# Altium schematic sheet LED7 SEGMENT.SchDoc
size A4
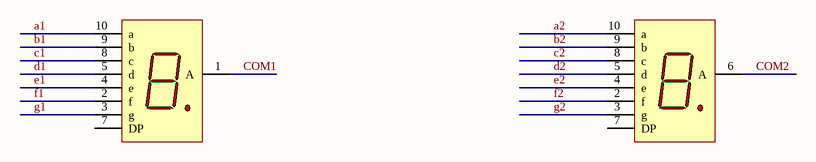
[diagram p0: LED7 SEGMENT.SchDoc]

## Parts
DS1  Dpy Red-CA  [7SEG-HY-A3613SR]  (value not drawn)
DS2  Dpy Red-CA  [7SEG-HY-A3613SR]  (value not drawn)

## Nets
a1: DS1.10(a)
a2: DS2.10(a)
b1: DS1.9(b)
b2: DS2.9(b)
c1: DS1.8(A)
c2: DS2.8(A)
COM1: DS1.1(A)
COM2: DS2.6(A)
d1: DS1.5(d)
d2: DS2.5(d)
e1: DS1.4(e)
e2: DS2.4(e)
f1: DS1.2(f)
f2: DS2.2(f)
g1: DS1.3(g)
g2: DS2.3(g)

Not connected (* = marked no-connect by the designer): DS1 7(DP); DS2 7(DP)

## Library data of the parts
DS1 DS2 = Dpy Red-CA: 7.62 mm Black Surface HER 7-Segment Display: CA, RH DP; MinimumIntensity: 360 ucd; Note: IF = 5 mA; Colour: High Efficiency Red (HER); Note: Pins 1 and 6 are redundant Anodes.; Published: 8-Jun-2000; LatestRevisionDate: 17-Dec-2003; LatestRevisionNote: Schematic revised, PCB Footprint replaced.; DatasheetVersion: 19-Feb-2002; PackageVersion: 11-Feb-2002; PackageReference: A; Publisher: Altium Limited; PackageDescription: LED, 7-Segment Display, 7.62 mm, RHD; 10 Leads; Row Space 5.08 mm; Pitch 2.54 mm; ComponentLink1Description: Manufacturer Link; ComponentLink1URL: http://www.agilent.com/